# EAGLE schematic Esquematico (EAGLE 9.7.0)
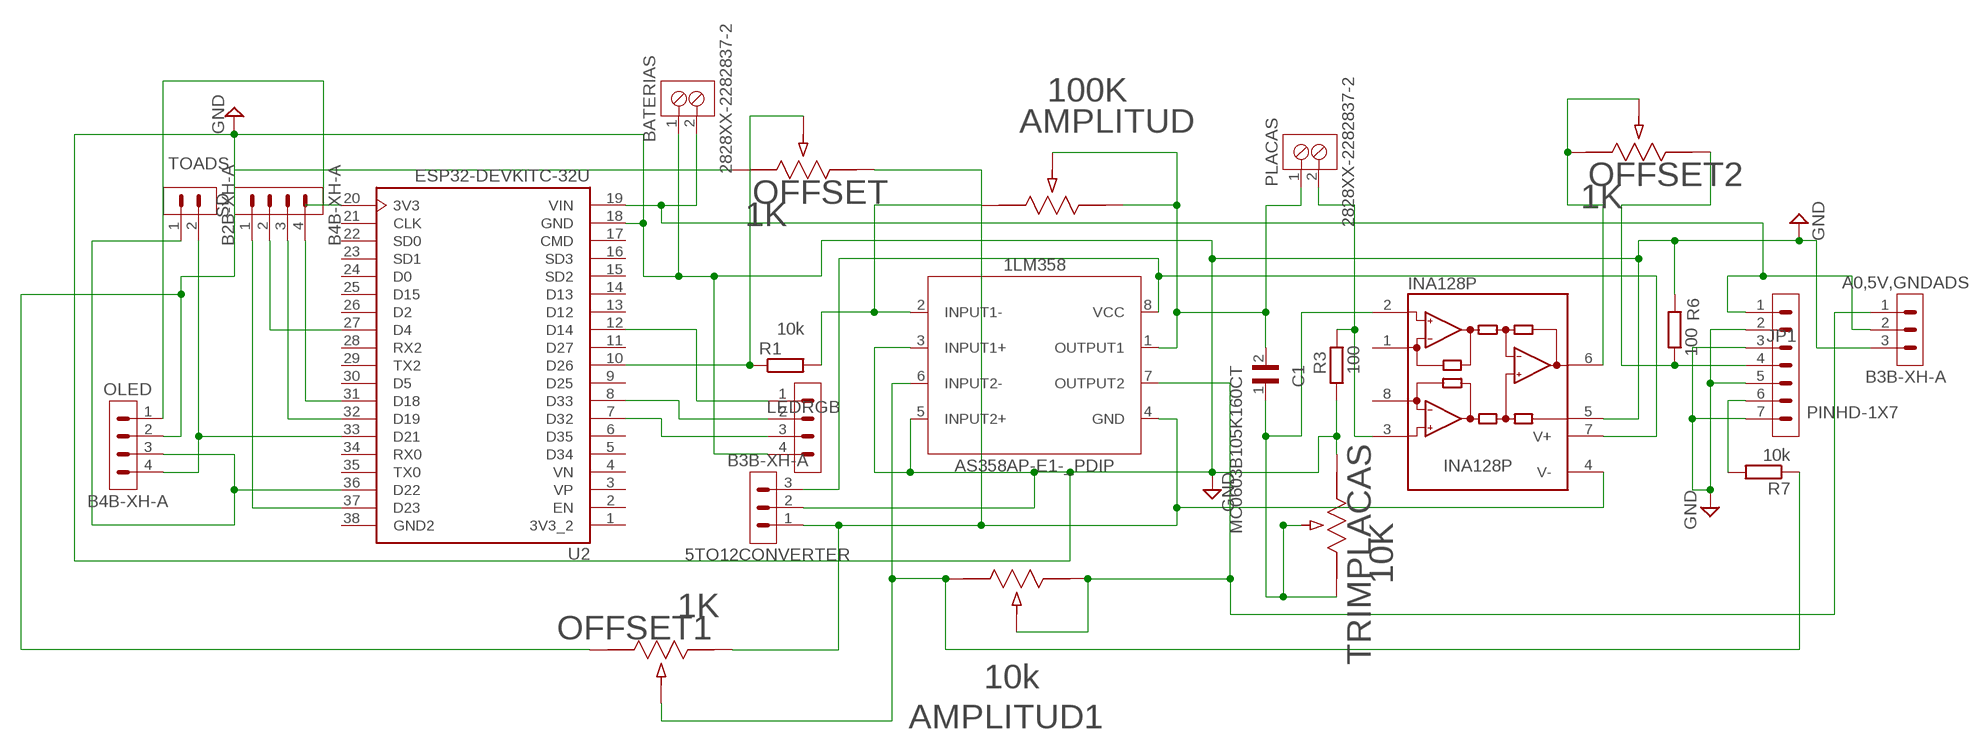
[diagram p0: schematic, sheet 1]

## Parts
1LM358  AS358AP-E1-_PDIP  [DIP762W56P254L930H431Q8B]
5TO12CONVERTER  B3B-XH-A  [B3B-XH-A]
A0,5V,GNDADS  B3B-XH-A  [B3B-XH-A]
AMPLITUD  100K  3296W-1-201LFPOT_3296W  [POT_3296W]
AMPLITUD1  10k  3296W-1-201LFPOT_3296W  [POT_3296W]
BATERIAS  2828XX-2282837-2  [TERMBLK_508-2N]
C1  MC0603B105K160CT  [CAPC1608X87N]
INA128P  INA128P  [DIL08]
JP1  PINHD-1X7  [1X07]
LEDRGB  B4B-XH-A  [B4B-XH-A]
OFFSET  1K  3296W-1-201LFPOT_3296W  [POT_3296W]
OFFSET1  1K  3296W-1-201LFPOT_3296W  [POT_3296W]
OFFSET2  1K  3296W-1-201LFPOT_3296W  [POT_3296W]
OLED  B4B-XH-A  [B4B-XH-A]
PLACAS  2828XX-2282837-2  [TERMBLK_508-2N]
R1  10k  R-EU_0207/10  [0207/10]
R3  100  R-EU_0207/10  [0207/10]
R6  100  R-EU_0207/10  [0207/10]
R7  10k  R-EU_0207/10  [0207/10]
SD  B4B-XH-A  [B4B-XH-A]
TOADS  B2B-XH-A  [B2B-XH-A]
TRIMPLACAS  10K  3296W-1-201LFPOT_3296W  [POT_3296W]
U2  ESP32-DEVKITC-32U  [MODULE_ESP32-DEVKITC-32U]

## Nets
+5V: A0,5V,GNDADS.2 BATERIAS.2 JP1.1 U2.19(VIN)
GND: 1LM358.3(INPUT1+) 1LM358.5(INPUT2+) 5TO12CONVERTER.2 A0,5V,GNDADS.3 BATERIAS.1 INA128P.5(REF) JP1.2 JP1.3 JP1.5 JP1.7 LEDRGB.4 OFFSET1.3 OFFSET.1 OLED.2 R3.1 R6.2 TRIMPLACAS.3 U2.18(GND)
N$1: LEDRGB.3 U2.7(D32)
N$2: INA128P.6(OUT) OFFSET2.1 OFFSET2.2
N$3: INA128P.3(+IN) PLACAS.2 R3.2
N$4: C1.1 INA128P.2(-IN) TRIMPLACAS.1 TRIMPLACAS.2
N$5: LEDRGB.2 U2.8(D33)
N$7: 1LM358.2(INPUT1-) AMPLITUD.1 R1.2
N$8: JP1.6 R7.2
N$10: JP1.4 OFFSET2.3 R6.1
N$12: SD.2 U2.27(D4)
N$13: U2.20(3V3)
N$14: SD.1 U2.37(D23)
N$15: 1LM358.6(INPUT2-) AMPLITUD1.3 OFFSET1.2 R7.1
N$16: 1LM358.7(OUTPUT2) A0,5V,GNDADS.1 AMPLITUD1.1 AMPLITUD1.2
N$17: OFFSET.2 R1.1 U2.10(D26)
N$18: LEDRGB.1 U2.12(D14)
N$21: SD.4 U2.31(D18)
N$24: SD.3 U2.32(D19)
N$28: 1LM358.1(OUTPUT1) AMPLITUD.2 AMPLITUD.3 C1.2 PLACAS.1
N$30: OLED.4 TOADS.2 U2.33(D21)
N$34: OLED.3 TOADS.1 U2.36(D22)
N$35: OLED.1
V+: 1LM358.8(VCC) 5TO12CONVERTER.3 INA128P.7(V+)
V-: 1LM358.4(GND) 5TO12CONVERTER.1 INA128P.4(V-) OFFSET1.1 OFFSET.3
Unconnected: INA128P.1(RG) INA128P.8(RG) U2.2(EN) U2.3(VP) U2.4(VN) U2.5(D34) U2.6(D35) U2.9(D25) U2.11(D27) U2.13(D12) U2.15(SD2) U2.16(SD3) U2.17(CMD) U2.21(CLK) U2.22(SD0) U2.23(SD1) U2.24(D0) U2.25(D15) U2.26(D2) U2.28(RX2) U2.29(TX2) U2.30(D5) U2.34(RX0) U2.35(TX0)

## Power pins joined to a net without a drawn wire
3V3_2: U2.1(3V3_2)
D13: U2.14(D13)
GND2: U2.38(GND2)

## Library data of the parts
1LM358 = IC_Linear:AS358*-?: Low power Dual Operation Amplifiers Reference: Datasheet <https://www.diodes.com/assets/Datasheets/AS358-358A-358B.pdf>; CATEGORY: Linear ICs; DATASHEET: https://www.diodes.com/assets/Datasheets/AS358-358A-358B.pdf; DESCRIPTION: General Purpose Operational Amplifiers 2 Circuit 36V 0.5 mA 2 mV 20 nA 8-PDIP; MANUFACTURER: Diodes Incorporated; MPN: AS358AP-E1; OPERATING_TEMPERATURE: -40°C ~ 85°C; PACKAGE_SIZE: 8-PDIP; PACKAGE_TYPE: Through Hole; PART_STATUS: Active; ROHS: Compliant; SERIES: AS358; SUBCATEGORY: Amplifiers; TYPE: General Purpose
5TO12CONVERTER A0,5V,GNDADS = Connector2:B3B-XH-A: XH Connector Top Entry - 3POS Reference: Datasheet <http://www.jst-mfg.com/product/pdf/eng/eXH.pdf>; CATEGORY: Connectors; DATASHEET: https://www.jst-mfg.com/product/pdf/eng/eXH.pdf; DESCRIPTION: Connector Header Through Hole 3 position 0.098" (2.50mm); MANUFACTURER: JST Sales America Inc.; MPN: B3B-XH-A; OPERATING_TEMPERATURE: -25°C ~ 85°C; PACKAGE_SIZE: NA; PACKAGE_TYPE: Through Hole; PART_STATUS: Active; PITCH: 0.098" (2.50mm); ROHS: Compliant; SERIES: XH; SUBCATEGORY: Rectangular Connectors; TYPE: Male Headers
AMPLITUD AMPLITUD1 OFFSET OFFSET1 OFFSET2 TRIMPLACAS = Trimm1:3296W-1-201LF; COPYRIGHT: Copyright (C) 2025 Ultra Librarian. All rights reserved.; MANUFACTURER_NAME: Bourns Electronics; MANUFACTURER_PART_NUMBER: 3296W-1-201LF
BATERIAS PLACAS = Connector:2828XX-2: 2 Position Wire to Board Terminal Block Horizontal with Board Reference: Datasheet <https://www.te.com.cn/commerce/DocumentDelivery/DDEController?Action=showdoc&DocId=Catalog+Section%7F1308389_EUROSTYLE_TERMINAL_BLOCKS%7F0607%7Fpdf%7FEnglish%7FENG_CS_1308389_EUROSTYLE_TERMINAL_BLOCKS_0607.pdf%7F2-282837-5>; CATEGORY: Connectors; DATASHEET: https://www.te.com/usa-en/product-282837-2.datasheet.pdf; DESCRIPTION: 2 Position Wire to Board Terminal Block Horizontal with Board 0.200" (5.08mm) Through Hole; MANUFACTURER: TE Connectivity AMP Connectors; MPN: 282837-2; OPERATING_TEMPERATURE: -40°C ~ 105°C; PACKAGE_SIZE: NA; PACKAGE_TYPE: Through Hole; PART_STATUS: Active; PITCH: 0.200" (5.08mm); ROHS: Compliant; SERIES: Buchanan; SUBCATEGORY: Terminal Blocks; TYPE: Screw Terminal - Rising Cage Clamp Side Wire Entry
C1 = MC0603B105K160CT:MC0603B105K160CT: Check availability <https://pricing.snapeda.com/parts/MC0603B105K160CT/Multicomp/view-part?ref=eda>; AVAILABILITY: Not in stock; CHECK_PRICES: https://www.snapeda.com/parts/MC0603B105K160CT/Multicomp/view-part/?ref=eda; DESCRIPTION: Cap, Mlcc, X7r, 1uf, 16v, 0603; MF: Multicomp; MP: MC0603B105K160CT; PACKAGE: 0603 Multicomp; PRICE: None; SNAPEDA_LINK: https://www.snapeda.com/parts/MC0603B105K160CT/Multicomp/view-part/?ref=snap
INA128P = burr-brown2:INA128: Instrumentation Amplifiers Precision, Low Power; MANUFACTURER: TEXAS INSTRUMENTS; MPN: INA128P
JP1 = Connector:PINHD-1X7: Pin Header; CATEGORY: Connectors; DESCRIPTION: Header-Straight-7 Position; PACKAGE_TYPE: Through Hole; PITCH: 0.100" (2.54mm); SUBCATEGORY: Headers; TYPE: Male Pins
LEDRGB OLED SD = Connector2:B4B-XH-A: XH Connector Top Entry - 4POS Reference: Datasheet <http://www.jst-mfg.com/product/pdf/eng/eXH.pdf>; CATEGORY: Connectors; DATASHEET: https://www.jst-mfg.com/product/pdf/eng/eXH.pdf; DESCRIPTION: Connector Header Through Hole 4 position 0.098" (2.50mm); MANUFACTURER: JST Sales America Inc.; MPN: B4B-XH-A; OPERATING_TEMPERATURE: -25°C ~ 85°C; PACKAGE_SIZE: NA; PACKAGE_TYPE: Through Hole; PART_STATUS: Active; PITCH: 0.098" (2.50mm); ROHS: Compliant; SERIES: XH; SUBCATEGORY: Rectangular Connectors; TYPE: Male Headers
R1 R3 R6 R7 = rclopia:R-EU_: RESISTOR, European symbol; SPICEPREFIX: R
TOADS = Connector2:B2B-XH-A: XH Connector Top Entry - 2POS Reference: : Datasheet <http://www.jst-mfg.com/product/pdf/eng/eXH.pdf>; CATEGORY: Connectors; DATASHEET: https://www.jst-mfg.com/product/pdf/eng/eXH.pdf; DESCRIPTION: Connector Header Through Hole 2 position 0.098" (2.50mm); MANUFACTURER: JST Sales America Inc.; MPN: B2B-XH-A; OPERATING_TEMPERATURE: -25°C ~ 85°C; PACKAGE_SIZE: NA; PACKAGE_TYPE: Through Hole; PART_STATUS: Active; PITCH: 0.098" (2.50mm); ROHS: Compliant; SERIES: XH; SUBCATEGORY: Rectangular Connectors; TYPE: Male Headers
U2 = ESP32-DEVKITC-32U:ESP32-DEVKITC-32U; MANUFACTURER: Espressif Systems; MAXIMUM_PACKAGE_HEIGHT: N/A; PARTREV: V4; STANDARD: Manufacturer Recommendations